# Altium schematic sheet PowerManagementModule.SchDoc: Icarus Power Management Module
size 431 x 279 mm; DrawnBy: J. Sullivan; Engineer: J. Sullivan; SheetNumber: 7; SheetTotal: 13; ENG_APP_DATE: 7/28/22
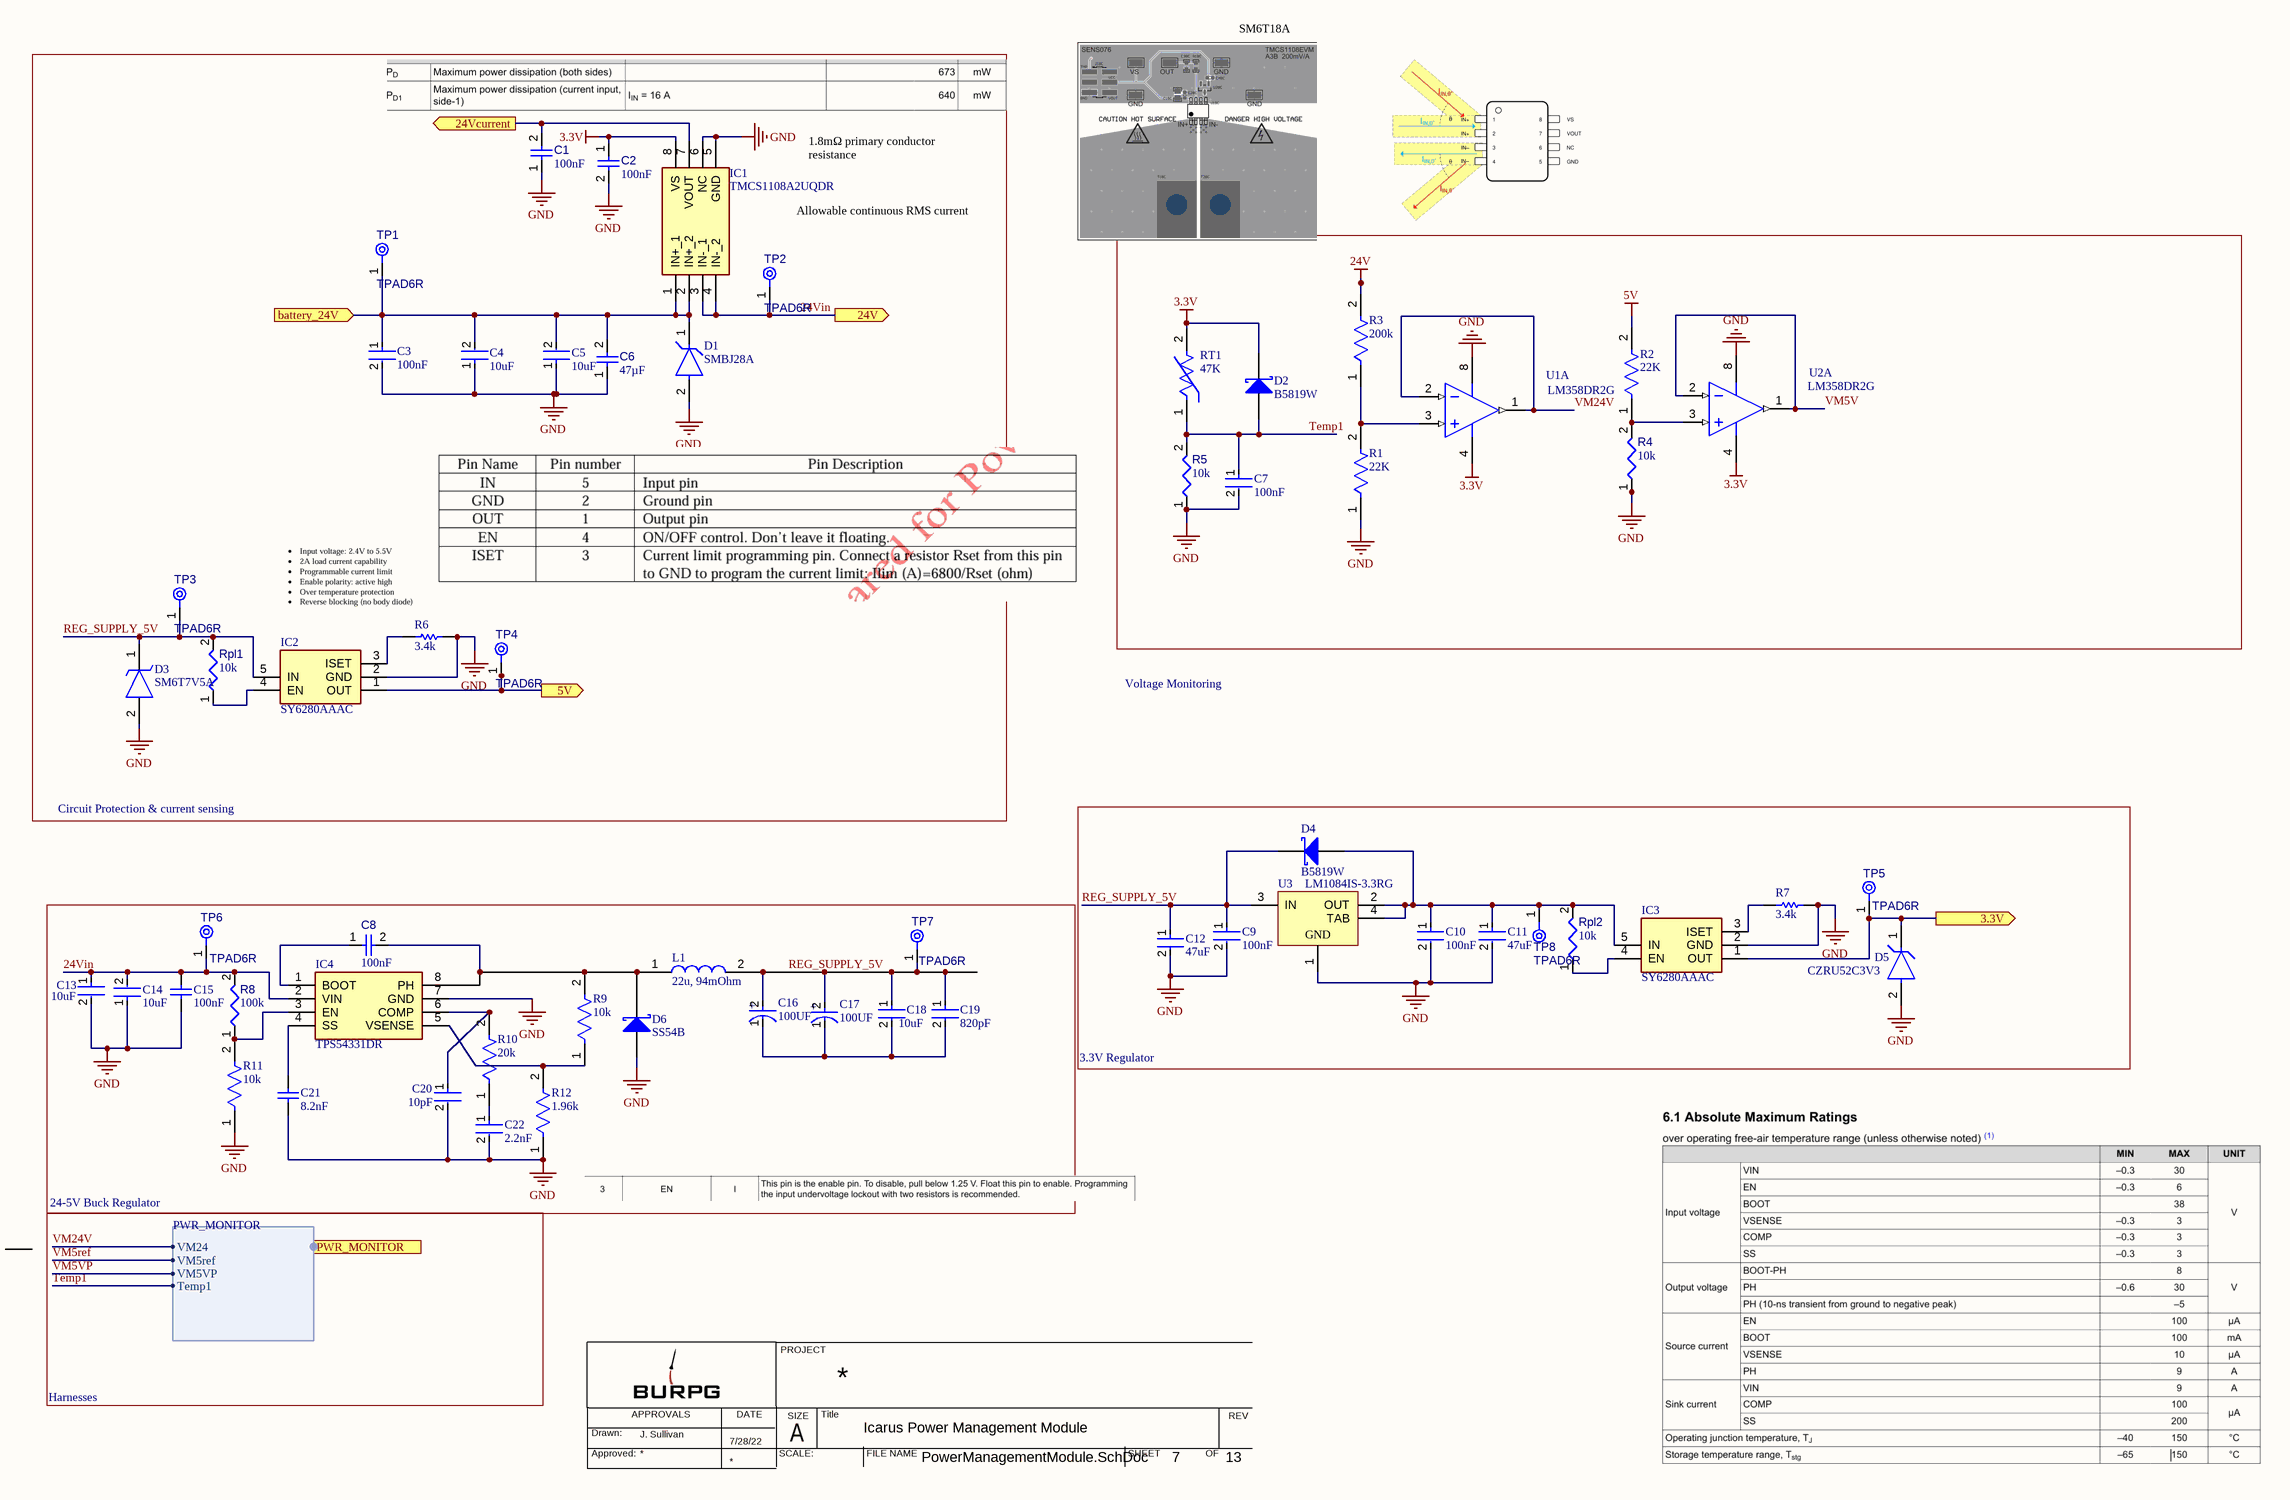
[diagram p0: PowerManagementModule.SchDoc]

## Parts
C1  value 100nF  [CAPC1005X56X25LL10T15]  (hidden comment: Capacitor 0.1 uF +/- 5% 16 V 0402)
C2  value 100nF  [CAPC1005X56X25LL10T15]  (hidden comment: Capacitor 0.1 uF +/- 5% 16 V 0402)
C3  100nF  [FP-CGA3E-0_3-0_1-IPC_A]
C4  10uF  [FP-GRM31-0_2-MFG]
C5  10uF  [FP-GRM31-0_2-MFG]
C6  value 47µF  [CAPC0805(2012)145_L]  (hidden comment: Capacitor 47µF +/-40% 6.3V 0805)
C7  100nF  [FP-CGA3E-0_3-0_1-IPC_A]
C8  value 100nF  [CAPC1608X90X40NL10T20]  (hidden comment: Capacitor 100 nF +/-10% 50 V 0603)
C9  100nF  [FP-CGA3E-0_3-0_1-IPC_A]
C10  100nF  [FP-CGA3E-0_3-0_1-IPC_A]
C11  47uF  [FP-C1210C476M4PACTU-MFG]
C12  47uF  [FP-C1210C476M4PACTU-MFG]
C13  10uF  [FP-GRM31-0_2-MFG]
C14  10uF  [FP-GRM31-0_2-MFG]
C15  100nF  [CAPC2013X100X50NL20T25]
C16  100UF  [FP-TPSC-MFG]
C17  100UF  [FP-TPSC-MFG]
C18  10uF  [FP-GRM21B-0_1-IPC_C]
C19  820pF  [FP-C0603C-CF-MFG]
C20  10pF  [FP-C0805C-DN-MFG]
C21  8.2nF  [CAPC1005X55X25NL05T10]
C22  2.2nF  [FP-CL21-IPC_C]
D1  SMBJ28A  [FP-SMBJ-MFG]
D2  B5819W  [MCC-SOD123_V]
D3  SM6T7V5A  [DIOM5436X265N]
D4  B5819W  [MCC-SOD123_V]
D5  CZRU52C3V3  [FP-0603-SOD-523F-MFG]
D6  SS54B  [JCET-SMB-2_M]
IC1  TMCS1108A2UQDR  [SOIC127P600X175-8N]
IC2  SY6280AAAC  [SOT95P285X140-5N]
IC3  SY6280AAAC  [SOT95P285X140-5N]
IC4  TPS54331DR  [SOIC127P600X175-8N]
L1  22u, 94mOhm  [INDPM8682X400N]
R1  22K  [FP-CRCW0603-e3-IPC_B]
R2  22K  [FP-CRCW0603-e3-IPC_B]
R3  200k  [FP-RC0603-0_55-IPC_B]
R4  value 10k  [RESC0402(1005)_L]  (hidden comment: 10KR2F)
R5  value 10k  [RESC0402(1005)_L]  (hidden comment: 10KR2F)
R6  3.4k  [RESC1609X50X30LL10T20]
R7  3.4k  [RESC1609X50X30LL10T20]
R8  value 100k  [RESC1608X55X25ML10T15]  (hidden comment: Resistor 100k +/-1% 0603 100 mW)
R9  10k  [FP-CRCW0805-e3-IPC_A]
R10  20k  [FP-CRCW0402-e3-IPC_B]
R11  10k  [FP-CRCW0805-e3-IPC_A]
R12  1.96k  [FP-CRCW0402-e3-MFG]
Rpl1  value 10k  [RESC0402(1005)_L]  (hidden comment: 10KR2F)
Rpl2  value 10k  [RESC0402(1005)_L]  (hidden comment: 10KR2F)
RT1  47K  [FP-NCP18-0_15-IPC_A]
TP1  TPAD6R  [TP06R]  (no BOM)
TP2  TPAD6R  [TP06R]  (no BOM)
TP3  TPAD6R  [TP06R]  (no BOM)
TP4  TPAD6R  [TP06R]  (no BOM)
TP5  TPAD6R  [TP06R]  (no BOM)
TP6  TPAD6R  [TP06R]  (no BOM)
TP7  TPAD6R  [TP06R]  (no BOM)
TP8  TPAD6R  [TP06R]  (no BOM)
U1  LM358DR2G  [ONSC-SOIC-8-751-07_V]  (part A of 2)
U2  LM358DR2G  [ONSC-SOIC-8-751-07_V]  (part A of 2)
U3  LM1084IS-3.3RG  [KTT0003B_N]

## Blocks framed on the sheet
Circuit Protection & current sensing: C1-C6 D1 D3 IC1 IC2 R6 Rpl1 TP1-TP4
3.3V Regulator: C9-C12 D4 D5 IC3 R7 Rpl2 TP5 TP8 U3
24-5V Buck Regulator: C8 C13-C22 D6 IC4 L1 R8-R12 TP6 TP7

## Ports
3.3V (out), 5V (out), 24V (out), 24Vcurrent (out), battery_24V (in), PWR_MONITOR (harness PWR_MONITOR)

## Harnesses
PWR_MONITOR: VM24, VM5ref, VM5VP, Temp1

## Nets
3.3V: C2.1 D2.2(K) IC1.8(VS) RT1.2 U1.4(VEE/GND) U2.4(VEE/GND)
5V: R2.2
24V: R3.2
GND: C1.1 C2.2 C3.2 C4.1 C5.1 C6.1 C7.2 C9.2 C10.2 C11.2 C12.2 C13.2 C14.1 C15.1 C20.2 C21.1 C22.2 D1.2(A) D3.2(A) D5.2(A) D6.1(A) IC1.5(GND) IC1.6(NC) IC2.2(GND) IC3.2(GND) IC4.7(GND) R1.1 R4.1 R5.1 R6.2 R7.2 R11.1 R12.1 U1.8(VCC) U2.8(VCC) U3.1(GND)
3.3V: D5.1(C) IC3.1(OUT) TP5.1(TP) ; port 3.3V  [a separate net that carries the same name]
5V: IC2.1(OUT) TP4.1(TP) ; port 5V  [a separate net that carries the same name]
24Vcurrent: C1.2 IC1.7(VOUT) ; port 24Vcurrent
24Vin: C13.1 C14.2 C15.2 IC1.3(IN-_1) IC1.4(IN-_2) IC4.2(VIN) R8.2 TP2.1(TP) TP6.1(TP) ; port 24V
battery_24V: C3.1 C4.2 C5.2 C6.2 D1.1(C) IC1.1(IN+_1) IC1.2(IN+_2) TP1.1(TP) ; port battery_24V
REG_SUPPLY_5V: C9.1 C12.1 C16.2(A) C17.2(A) C18.1 C19.1 D3.1(K) D4.2(K) IC2.5(IN) L1.2 Rpl1.2 TP3.1(TP) TP7.1(TP) U3.3(IN)
Temp1: C7.1 D2.1(A) R5.2 RT1.1 ; port PWR_MONITOR.Temp1
VM5ref: port PWR_MONITOR.VM5ref
VM5V: U2.1(OUTA) U2.2(INA-)
VM5VP: port PWR_MONITOR.VM5VP
VM24V: U1.1(OUTA) U1.2(INA-) ; port PWR_MONITOR.VM24
NetC8_1: C8.1 IC4.1(BOOT)
NetC8_2: C8.2 D6.2(K) IC4.8(PH) L1.1 R9.2
NetC10_1: C10.1 C11.1 D4.1(A) IC3.5(IN) Rpl2.2 TP8.1(TP) U3.2(OUT) U3.4(TAB)
NetC16_1: C16.1(C) C17.1(C) C18.2 C19.2
NetC20_1: C20.1 IC4.6(COMP) R10.2
NetC21_2: C21.2 IC4.4(SS)
NetC22_1: C22.1 R10.1
NetIC2_3: IC2.3(ISET) R6.1
NetIC2_4: IC2.4(EN) Rpl1.1
NetIC3_3: IC3.3(ISET) R7.1
NetIC3_4: IC3.4(EN) Rpl2.1
NetIC4_3: IC4.3(EN) R8.1 R11.2
NetIC4_5: IC4.5(VSENSE) R9.1 R12.2
NetR1_2: R1.2 R3.1 U1.3(INA+)
NetR2_1: R2.1 R4.2 U2.3(INA+)

## Notes on the sheet
- SM6T18A
- 1.8mΩ primary conductor resistance
- Allowable continuous RMS current ~25A
- Voltage Monitoring
- Harnesses
- PROJECT
- Drawn:
- Approved:
- APPROVALS
- DATE
- SCALE:
- SIZE
- A
- Title
- FILE NAME
- SHEET
- OF
- REV
- (in symbol CMP-2000-07294-2) +

## Library data of the parts
C1 C2 = CMP-001-00001-6: Chip Capacitor, 0.1 uF, +/- 5%, 16 V, 0402 (1005 Metric); Capacitor Type: Ceramic; Voltage Rating: 16V; Max Operating Temperature: 125°C; Min Operating Temperature: -55°C; Case/Package: 0402; Mounting Technology: SM; Pins: 2; Tolerance: 5%; RoHS Compliant: True
C3 C7 C9 C10 = CMP-2000-07546-2: Cap Ceramic 100nF 50V X7R 10% Pad SMD 0603 +125°C Automotive T/R; Weight: 7.1E-05oz; Composition: Ceramic; Max Operating Temperature: 125°C; Termination: SMD/SMT; Dielectric: X7R; Length: 1.6mm; Package Quantity: 1; REACH SVHC: No SVHC; Lead Free: Lead Free; Case Code (Metric): 1608; Min Operating Temperature: -55°C; Packaging: Tape and Reel; Tolerance: 10%; Voltage Rating: 50V; Case Code (Imperial): 0603; Capacitance: 100nF; Case/Package: 0603; Voltage Rating (DC): 50V; Depth: 0.8mm; Radiation Hardening: No; Ratings: AEC-Q200; Mount: Surface Mount; Voltage: 50V; Thickness: 0.035inch; Width: 0.8mm; Height: 0.8mm
C4 C5 C13 C14 = CMP-2000-05256-2: CAP CER 10UF 50V X5R 1206; Manufacturer: Murata Electronics North America; Manufacturer Part Number: GRM31CR61H106KA12L; Tolerance: 10%; Temperature Coefficient: 15%; Material: Ceramic; Height: 1.8mm; Temperature: -55°C to +85°C; Lead Free: Yes; Temperature Characteristic: X5R; ComponentLink2Description: Datasheet; Digikey Description: CAP CER 10UF 50V X5R 1206; Octopart: https://octopart.com/grm31cr61h106ka12l-murata-18903335; Device Class L2: Capacitors; Automotive: No; Value: 10uF; Temperature Range High: +85°C; Temperature Range Low: -55°C; Device Class L3: Ceramic Capacitors; Voltage Rating: 50V; Capacitance: 10uF; Device Class L1: Passive Components; Mouser Description: Multilayer Ceramic Capacitors MLCC - SMD/SMT 1206 10uF 50volt X5R +/-10%; ComponentLink2URL: https://search.murata.co.jp/Ceramy/image/img/A01X/G101/ENG/GRM31CR61H106KA12-01A.pdf; Package: GRM31-0.2; RoHS: TRUE; Category: Cap
C6 = CMP-001-00082-4: Chip Capacitor, 47µF +/-40%, 50V, 0805, Thickness 1.45 mm; Tolerance: 10%; Min Operating Temperature: -55°C; Max Operating Temperature: 85°C; Case/Package: 0805; Pins: 2; Mounting Technology: SMT; Voltage Rating: 6.3V
C8 = CMP-001-00017-6: Chip Capacitor, 100 nF, +/- 10%, 50 V, 0603 (1608 Metric); Voltage Rating: 50V; Capacitor Type: Ceramic; Tolerance: 10%; Mounting Technology: SM; Max Operating Temperature: 125°C; RoHS Compliant: True; Pins: 2; Case/Package: 0603; Min Operating Temperature: -55°C
C11 C12 = CMP-2000-06020-2: CAP CER 47UF 16V X5R 1210; Tolerance: 20%; Dissipation Factor: 10%; Dielectric Material: Ceramic; Dielectric: X5R; Capacitance: 47uF; Packaging: Tape and Reel; Length: 3.2mm; Mount: Surface Mount; Max Operating Temperature: 85°C; Series: C; Case Code (Imperial): 1210; Depth: 2.5mm; Thickness: 0.11inch; Radiation Hardening: No; Width: 0.098inch; Lead Free: Lead Free; Case Code (Metric): 3225; Voltage: 16V; Voltage Rating: 16V; Voltage Rating (DC): 16V; Case/Package: 1210; Min Operating Temperature: -55°C; REACH SVHC: No SVHC; Number of Pins: 2; Termination: SMD/SMT; RoHS Compliant: Yes; Contact Plating: Tin; Package Quantity: 1; Height: 2.5mm
C15 = CMP-2007-03708-1: C0805F103K5RACTU 10000 pF ±10% 50V Ceramic Capacitor X7R 0805 (2012 Metric); Manufacturer: Kemet; Part Number: C0805F103K5RACTU
C16 C17 = CMP-2000-07294-2: CAP TANT 100UF 10% 25V 2312; Voltage Rating: 10V; Leakage Current: 10uA; Dissipation Factor: 8%; Dielectric Material: Tantalum; ESR (Equivalent Series Resistance): 100mR; Polarity: Polar; Depth: 3.2mm; Number of Pins: 2; Height - Seated (Max): 0.11inch; Case Code (Imperial): 2412; Lead Pitch: 2.9mm; Package Quantity: 1; Size: 2.6mm; Case Code (Metric): 6032; Termination: SMD/SMT; Mount: Surface Mount; Height: 2.6mm; Max Operating Temperature: 125°C; Width: 3.2mm; Radiation Hardening: No; REACH SVHC: No SVHC; Capacitance: 100uF; Packaging: Tape and Reel; Voltage: 10V; Construction: Flat; Case/Package: 6032-28; Features: General Purpose; Lead Free: Lead Free; Length: 6mm; Voltage Rating (DC): 10V; Tolerance: 10%; RoHS Compliant: Yes; Min Operating Temperature: -55°C; Series: TPS
C18 = CMP-2007-03453-2: Chip Multilayer Ceramic Capacitors for General Purpose, 0805, 10uF, X5R, 15%, 10%, 25V; Voltage Rating (DC): 16V; Radiation Hardening: No; Thickness: 0.053inch; Lead Free: Lead Free; Package Quantity: 1; Width: 1.25mm; Case Code (Imperial): 0805; Depth: 1.25mm; Packaging: Tape and Reel; Dielectric: X5R; Max Operating Temperature: 85°C; Tolerance: 10%; Voltage Rating: 16V; Voltage: 16V; Capacitance: 10uF; Height: 1.25mm; Case Code (Metric): 2012; Material: Ceramic; Mount: Surface Mount; Case/Package: 0805; REACH SVHC: No SVHC; Length: 2mm; Min Operating Temperature: -55°C; Termination: SMD/SMT
C19 = CMP-2006-03275-2: C0603C 820pF Ceramic Multilayer Capacitor; 50 VDC; +125degC; X7R Dielec; +/-10%; Manufacturer Part Number: C0603C821K5RACTU; Manufacturer: KEMET; Voltage Rating: 50 V; Tolerance: 0.1; Automotive Grade: Grade 1; Temperature Coefficient: 30ppm/°C; Material: Ceramic; Temperature: -55°C to +125°C; Value: 820 pF; Temperature Range High: +125°C; ComponentLink2URL: https://api.kemet.com/component-edge/download/datasheet/C0603C100J5GACAUTO.pdf; Digikey Description: C0603C 820pF Ceramic Multilayer Capacitor; 50 VDC; +125degC; X7R Dielec; +/-10%; Mouser Description: C0603C 820pF Ceramic Multilayer Capacitor, 50 VDC, +125degC, X7R Dielec, +/-10%; Temperature Range Low: -55°C; Height: 0.87mm; Octopart: https://octopart.com/c0603c821k5ractu-kemet-129686; Capacitance: 820 pF; Package: C0603C-CF; RoHS: TRUE; Device Class L1: Passive Components; ComponentLink2Description: Datasheet; Automotive: Yes; Device Class L3: Ceramic Capacitors; Device Class L2: Capacitors; Category: Cap; Temperature Characteristic: X7R; Lead Free: Yes
C20 = CMP-2007-00462-2: CAP CER 10PF 50V 10% NP0 0805C0805C100K5GACTU; Manufacturer: KEMET; Temperature Characteristic: C0G; Material: Ceramic; Temperature Coefficient: 30ppm/°C; Tolerance: 0.1; Package: C0805C-DN; Device Class L2: Capacitors; Mouser Description: Multilayer Ceramic Capacitors MLCC - SMD/SMT 50volts 10pF C0G 10%; ComponentLink2URL: https://content.kemet.com/datasheets/KEM_C1003_C0G_SMD.pdf; Automotive: No; Device Class L3: Ceramic Capacitors; Temperature: -55°C to +125°C; Manufacturer Part Number: C0805C100K5GACTU; Digikey Description: CAP CER 10PF 50V 10% NP0 0805; RoHS: TRUE; Temperature Range High: +125°C; Value: 10 pF; Capacitance: 10 pF; Category: Cap; Voltage Rating: 50 V; Octopart: https://octopart.com/c0805c100k5gactu-kemet-8089747; Height: 0.88mm; Lead Free: Yes; Ipc Land Pattern Name: CAPC200125X78; Temperature Range Low: -55°C; Device Class L1: Passive Components; ComponentLink2Description: Datasheet
C21 = CMP-2008-03950-1: GRM155R71C822KA01D 0402  8.2nF; Manufacturer: Murata; Part Number: GRM155R71C822KA01D
C22 = CMP-13271-001564-1: CL21 Series 0805 2.2nF 50V ±5% Tolerance C0G Multilayer Ceramic Chip Capacitor CL21C222JBFNNNE; Mount: Surface Mount; Packaging: Tape and Reel; Tolerance: 5%; Thickness: 0.053inch; Case Code (Imperial): 0805; Capacitance: 2.2nF; Min Operating Temperature: -55°C; Width: 0.049inch; Package Quantity: 2000; Depth: 1.25mm; Radiation Hardening: No; Voltage Rating (DC): 50V; Case/Package: 0805; Voltage: 50V; Max Operating Temperature: 125°C; Case Code (Metric): 2012; Voltage Rating: 50V; Length: 2mm; Dielectric: C0G; Height: 1.25mm; Lead Free: Lead Free
D1 = CMP-08607-000081-1: TVS DIODE 28V 45.4V DO214AA; Manufacturer: Littelfuse Inc; Breakdown Voltage: 31.1V; Direction: Unidirectional; Number Of Channels: 1; Peak Pulse Power: 600W; Max Junction Temp: +150°C; Peak Pulse Current: 13.3A; Temperature: -65°C to +150°C; Category: Diode; RoHS: TRUE; Height: 2.61mm; Reverse Standoff Voltage: 28V; Device Class L1: Circuit Protection; Temperature Range Low: -65°C; ComponentLink2Description: Datasheet; Digikey Description: TVS DIODE 28V 45.4V DO214AA; Automotive: No; Package: SMBJ; Mouser Description: Littelfuse SMBJ28A, Uni-Directional TVS Diode, 600W, 2-Pin DO-214AA; ComponentLink2URL: https://www.littelfuse.com/~/media/electronics/datasheets/tvs_diodes/littelfuse_tvs_diode_smbj_datasheet.pdf.pdf; Manufacturer Part Number: SMBJ28A; Octopart: https://octopart.com/smbj28a-littelfuse-350790; Clamping Voltage: 45.4V; Temperature Range High: +150°C; Device Class L3: unset; Device Class L2: TVS Diodes; Lead Free: Yes
D2 D4 = CMP-004-00005-2: Schottky Barrier Rectifier, 40 V, 1 A, -65 to 125 degC, 2-Pin SOD123, RoHS, Tape and Reel; Manufacturer: Micro Commercial Components; Datasheet Version: Rev. B, 01/2013; RoHS Compliant: Unknown; Manufacturer URL: http://www.mccsemi.com/; Package URL: http://www.mccsemi.com/up_pdf/1N4448W(SOD-123).pdf; Case/Package: SOD123; Mounting Technology: SM; Datasheet URL: http://www.mccsemi.com/up_pdf/B5817W-B5819W(SOD-123).pdf; Package Description: 2-Pin Small Outline Diode, Body 2.7 x 1.6 mm, Height 1.35 mm; Package Reference: SOD123
D3 = SM6T7V5A: TVS Diode (Uni-directional); Manufacturer_Name: STMicroelectronics; Datasheet Link: https://www.st.com/resource/en/datasheet/sm6t100a.pdf; Height: 2.65mm; Manufacturer_Part_Number: SM6T7V5A; Mouser Part Number: 511-SM6T7V5A; Mouser Price/Stock: https://www.mouser.co.uk/ProductDetail/STMicroelectronics/SM6T7V5A?qs=DcAdhm6iCnod0UVazzWDng%3D%3D; Arrow Part Number: SM6T7V5A; Arrow Price/Stock: https://www.arrow.com/en/products/sm6t7v5a/stmicroelectronics?region=nac
D5 = CMP-20229-000003-1: DIODE ZENER 3.3V 150MW 0603; Zener Current: 5mA; Tolerance: 5%; Output Current: 500mA; Impedance: 95R; Element Configuration: Single; Max Reverse Leakage Current: 25uA; Max Operating Temperature: 125°C; Max Power Dissipation: 150mW; Power Rating: 150mW; Lead Free: Lead Free; Mount: Surface Mount; Packaging: Tape and Reel; Voltage Tolerance: 5%; Power Dissipation: 150mW; Zener Voltage: 3.3V; Min Operating Temperature: -55°C; Case/Package: SMD/SMT; Voltage Rating (DC): 3.3V; Package Quantity: 1
D6 = CMP-004-00006-2: Schottky Barrier Rectifier, 40 V, 5 A, -55 to 150 degC, 2-Pin SMD; Manufacturer: JCET; Datasheet URL: http://wiki.seeedstudio.com/images/3/3f/0310130P1.pdf; Datasheet Version: May-13; Package Reference: SMB-2; RoHS Compliant: Unknown; Manufacturer URL: http://www.cj-elec.com/; Mounting Technology: SM; Package Description: 2-Pin Surface Mount Device, Body 4.315 x 3.62 mm; Case/Package: SMB-2
IC1 = TMCS1108A2UQDR: Integrated Circuit, –2.8 A → 27.7 A / https://www.ti.com/lit/ds/symlink/tmcs1108-q1.pdf?HQS=dis-dk-null-digikeymode-dsf-pf-null-wwe&ts=1751879552762; Manufacturer_Name: Texas Instruments; Datasheet Link: https://www.ti.com/lit/ds/symlink/tmcs1108.pdf?HQS=dis-dk-null-digikeymode-dsf-pf-null-wwe&ts=1716768799776; Height: 1.75mm; Manufacturer_Part_Number: TMCS1108A2UQDR; Mouser Part Number: 595-TMCS1108A2UQDR; Mouser Price/Stock: https://www.mouser.co.uk/ProductDetail/Texas-Instruments/TMCS1108A2UQDR?qs=pUKx8fyJudDyYFsofofVeQ%3D%3D; Arrow Part Number: TMCS1108A2UQDR; Arrow Price/Stock: https://www.arrow.com/en/products/tmcs1108a2uqdr/texas-instruments?region=nac
IC2 IC3 = SY6280AAAC: Integrated Circuit; Manufacturer_Name: Silergy; Datasheet Link: https://datasheet.lcsc.com/szlcsc/Silergy-Corp-SY6280AAAC_C207620.pdf; Height: 1.4mm; Manufacturer_Part_Number: SY6280AAAC
IC4 = TPS54331DR: Integrated Circuit; Manufacturer_Name: Texas Instruments; Datasheet Link: http://www.ti.com/lit/gpn/tps54331; Height: 1.75mm; Manufacturer_Part_Number: TPS54331DR; Mouser Part Number: 595-TPS54331DR; Mouser Price/Stock: https://www.mouser.co.uk/ProductDetail/Texas-Instruments/TPS54331DR?qs=QyYHynRG50rsSYcB%2Ftz4Yw%3D%3D; Arrow Part Number: TPS54331DR; Arrow Price/Stock: https://www.arrow.com/en/products/tps54331dr/texas-instruments?utm_currency=USD&region=nac
L1 = IHLP3232DZER220M11: Inductor， IHLP3232DZER220M11, 3.3A sat; Manufacturer_Name: Vishay; Datasheet Link: http://uk.rs-online.com/web/p/products/8523797; Height: 4mm; Manufacturer_Part_Number: IHLP3232DZER220M11; Mouser Part Number: 70-IHLP3232DZER220M1; Mouser Price/Stock: https://www.mouser.co.uk/ProductDetail/Vishay-Dale/IHLP3232DZER220M11?qs=Nbmv7C3%2FzlDWnanygNMaBQ%3D%3D; Arrow Part Number: IHLP3232DZER220M11; Arrow Price/Stock: https://www.arrow.com/en/products/ihlp3232dzer220m11/vishay?utm_currency=USD&region=nac
R1 R2 = CMP-2000-03092-2: RES Thick Film, 22kΩ, 1%, 0.1W, 100ppm/°C, 0603; Voltage Rating: 75V; Max Power Dissipation: 100mW; Resistance: 22kR; Radiation Hardening: No; Termination: SMD/SMT; Composition: Thick Film; Tolerance: 1%; Temperature Coefficient: 100ppm/°C; Case Code (Imperial): 0603; Height: 0.45mm; Packaging: Tape and Reel; Power Rating: 100mW; Case/Package: 0603; Number of Terminations: 2; Package Quantity: 10; Weight: 7.1E-05oz; Voltage Rating (DC): 75V; Max Operating Temperature: 155°C; Contact Plating: Tin; Width: 0.85mm; Case Code (Metric): 1608; Mount: Surface Mount; Min Operating Temperature: -55°C; Depth: 0.85mm; Features: Automotive AEC-Q200; Military Standard: Not; Lead Free: Lead Free; Length: 1.55mm
R3 = CMP-03412-037786-1: RES SMD 200K OHM 1% 1/10W 0603; Temperature Coefficient: 100ppm/°C; Voltage Rating: 50V; Resistance: 200kR; Max Power Dissipation: 100mW; Packaging: Tape and Reel; REACH SVHC: No SVHC; Resistance Tolerance: 1%; Number of Pins: 2; Width: 0.031inch; Termination: SMD/SMT; Features: Moisture Resistant; Tolerance: 1%; Series: RC; Case Code (Imperial): 0603; Depth: 0.8mm; Number of Terminations: 2; Max Operating Temperature: 155°C; Resistor Type: Thick Film; Height: 0.022inch; Lead Free: Lead Free; Construction: Rectangular; Case/Package: 0603; Power Rating: 100mW; Case Code (Metric): 1608; Length: 1.6mm; Size Code: 0603; RoHS Compliant: Yes; Military Standard: Not; Min Operating Temperature: -55°C; Package Quantity: 1; Voltage Rating (DC): 50V
R4 R5 Rpl1 Rpl2 = CMP-009-00066-2: 10K 0.063W 1% 0402 (1005 Metric)  SMD; Power: 63mW; Case/Package: 0402; Mounting Technology: SMT; Pins: 2; Tolerance: 1%
R6 R7 = CMP-2000-03303-1: CRCW06033K40FKEA Fixed Resistor, Metal Glaze/thick Film, 0.1W, 3400ohm, 75V, 1% +/-Tol, 100ppm/Cel, Surface Mount, 0603; Manufacturer: Vishay Dale; Part Number: CRCW06033K40FKEA
R8 = CMP-009-00023-5: Chip Resistor, 100 KOhm, +/- 1%, 0.1 W, -55 to 155 degC, 0603 (1608 Metric); Voltage Rating: 50V; Power: 100mW; Max Operating Temperature: 155°C; RoHS Compliant: True; Tolerance: 1%; Pins: 2; Case/Package: 0603; Mounting Technology: SM; Min Operating Temperature: -55°C
R9 R11 = CMP-2001-04908-2: RES Thick Film, 10kΩ, 1%, 0.125W, 100ppm/°C, 0805; Resistance: 10kR; Voltage Rating (DC): 150V; Power Rating: 125mW; Weight: 0.000194oz; Package Quantity: 5000; Military Standard: Not; Max Operating Temperature: 155°C; Temperature Coefficient: 100ppm/°C; Contact Plating: Tin; Width: 1.25mm; Height: 0.45mm; Radiation Hardening: No; Tolerance: 1%; Min Operating Temperature: -55°C; Voltage Rating: 150V; Length: 2mm; Depth: 1.25mm; Termination: SMD/SMT; Packaging: Tape and Reel; Case/Package: 0805; Case Code (Metric): 2012; Lead Free: Lead Free; Case Code (Imperial): 0805; Composition: Thick Film
R10 = CMP-2002-08356-2: RES Thick Film, 20kΩ, 1%, 0.063W, 100ppm/°C, 0402; Max Power Dissipation: 63mW; Working Voltage: 50V; Resistance: 20kR; Contact Plating: Tin; Packaging: Tape and Reel; Height: 0.35mm; Case Code (Imperial): 0402; Tolerance: 1%; Width: 0.5mm; Composition: Thick Film; Mount: Surface Mount; Termination: SMD/SMT; Number of Pins: 2; Number of Terminations: 2; Length: 1mm; Temperature Coefficient: 100ppm/°C; Case Code (Metric): 1005; Voltage Rating: 50V; Lead Free: Lead Free; Voltage Rating (DC): 50V; Min Operating Temperature: -55°C; Max Operating Temperature: 155°C; Package Quantity: 10; Radiation Hardening: No; Weight: 2.3E-05oz; Military Standard: Not; Case/Package: 0402; Power Rating: 63mW; Depth: 0.5mm; Features: Automotive AEC-Q200
R12 = CMP-2002-08313-2: CRCW04021K96FKED  RES Thick Film, 1.96kΩ, 1%, 0.063W, 100ppm/°C, 0402; Power Rating: 63mW; Voltage Rating: 50V; Resistance: 1.96kR; Number of Terminations: 2; Number of Pins: 2; Temperature Coefficient: 100ppm/°C; Min Operating Temperature: -55°C; Height: 0.35mm; Max Operating Temperature: 155°C; Package Quantity: 10; Width: 0.5mm; Features: Automotive AEC-Q200; Termination: SMD/SMT; Contact Plating: Tin; Composition: Thick Film; Max Power Dissipation: 63mW; Case/Package: 0402; Case Code (Imperial): 0402; Packaging: Tape and Reel; Tolerance: 1%; Length: 1mm; Depth: 0.5mm; Case Code (Metric): 1005; Weight: 2.3E-05oz; Military Standard: Not; Radiation Hardening: No
RT1 = CMP-06022-000553-2: NTC Thermistor for Temperature Sensor, 0603, 47kΩ, 5%, 0.046mA, 5V; Power Rating: 100mW; Current Rating: 140uA; Resistance: 47kR; Accuracy: 0.5%; Resistance Tolerance: 5%; Max Operating Temperature: 125°C; Number of Pins: 2; Length: 1.6mm; Max Power Dissipation: 100mW; Case Code (Metric): 1608; REACH SVHC: No SVHC; Height: 0.8mm; Termination: SMD/SMT; Series: NCP; Depth: 0.8mm; Mount: Surface Mount; Min Operating Temperature: -40°C; Case/Package: 0603; Case Code (Imperial): 0603; Packaging: Tape and Reel; Tolerance: 5%; Package Quantity: 4000; Width: 0.8mm; Thickness: 150um; Radiation Hardening: No; Lead Free: Lead Free
TP1-TP8 = CMP-00028-00002-2: 0.6mm round; Pins: 1
U1 U2 = CMP-014-00017-2: Single Supply Dual Operational Amplifier, 3 to 32 V, 0 to 70 degC, 8-Pin SOIC, Pb-Free, Tape and Reel; Manufacturer: ON Semiconductor; Max Supply Voltage: 44V; Max Input Voltage: 28.3V; Nominal Voltage Gain: 100dB; Slew Rate: 0.07V/us; Common Mode Rejection Ratio: 65dB; Nominal Supply Voltage: 12V; Min Supply Voltage: 2.3V; Channels: 2; Max Dual Supply Voltage: 16V; Nominal Supply Current: 35uA; Output Current: 40mA; Min Dual Supply Voltage: 1.5V; Nominal Gain Bandwith Product: 200KHz; Min Input Voltage: 0uV; Package Reference: SOIC-8-751-07; Package Description: 8-Pin Small Outline Integrated Circuit, Body 4.9 x 3.9 mm, Pitch 1.27 mm; Min Operating Temperature: 0°C; Max Operating Temperature: 70°C; Case/Package: SOIC; Datasheet URL: http://www.onsemi.cn/pub_link/Collateral/LM358-D.PDF; Manufacturer URL: http://www.onsemi.com/; Packaging: TapeandReel; Pins: 8; RoHS Compliant: True; Datasheet Version: Rev. 32, 10/2016; Package Quantity: 2500; Nominal Dual Supply Voltage: 12V; Mounting Technology: SM
U3 = CMP-0062-00591-5: 5A Low Dropout Positive Regulators, 3-pin TO-263, Pb-Free; PartNumber: LM1084IS-3.3/NOPB; Manufacturer: Texas Instruments; High-Reliability: Y; CompType: LDO IC; PowerWise: N; PackageTopMarking: NSUZXYTTE#*LM1084*IS-3.3; PinCount: 3; ComponentLink1Description: Datasheet URL; Code_JEDEC: MO-169-AA; PackageDescription: TO-263, Molded, .400 x .390 x .180in, 3 Lead, .1in Pitch, Surface Mount; PackageReference: KTT0003B; RoHS: Y; ComponentLink1URL: http://www.ti.com/general/docs/lit/getliterature.tsp?genericPartNumber=LM1084&fileType=pdf